# Altium schematic sheet 08-AUDIO_AUX.SchDoc
size B
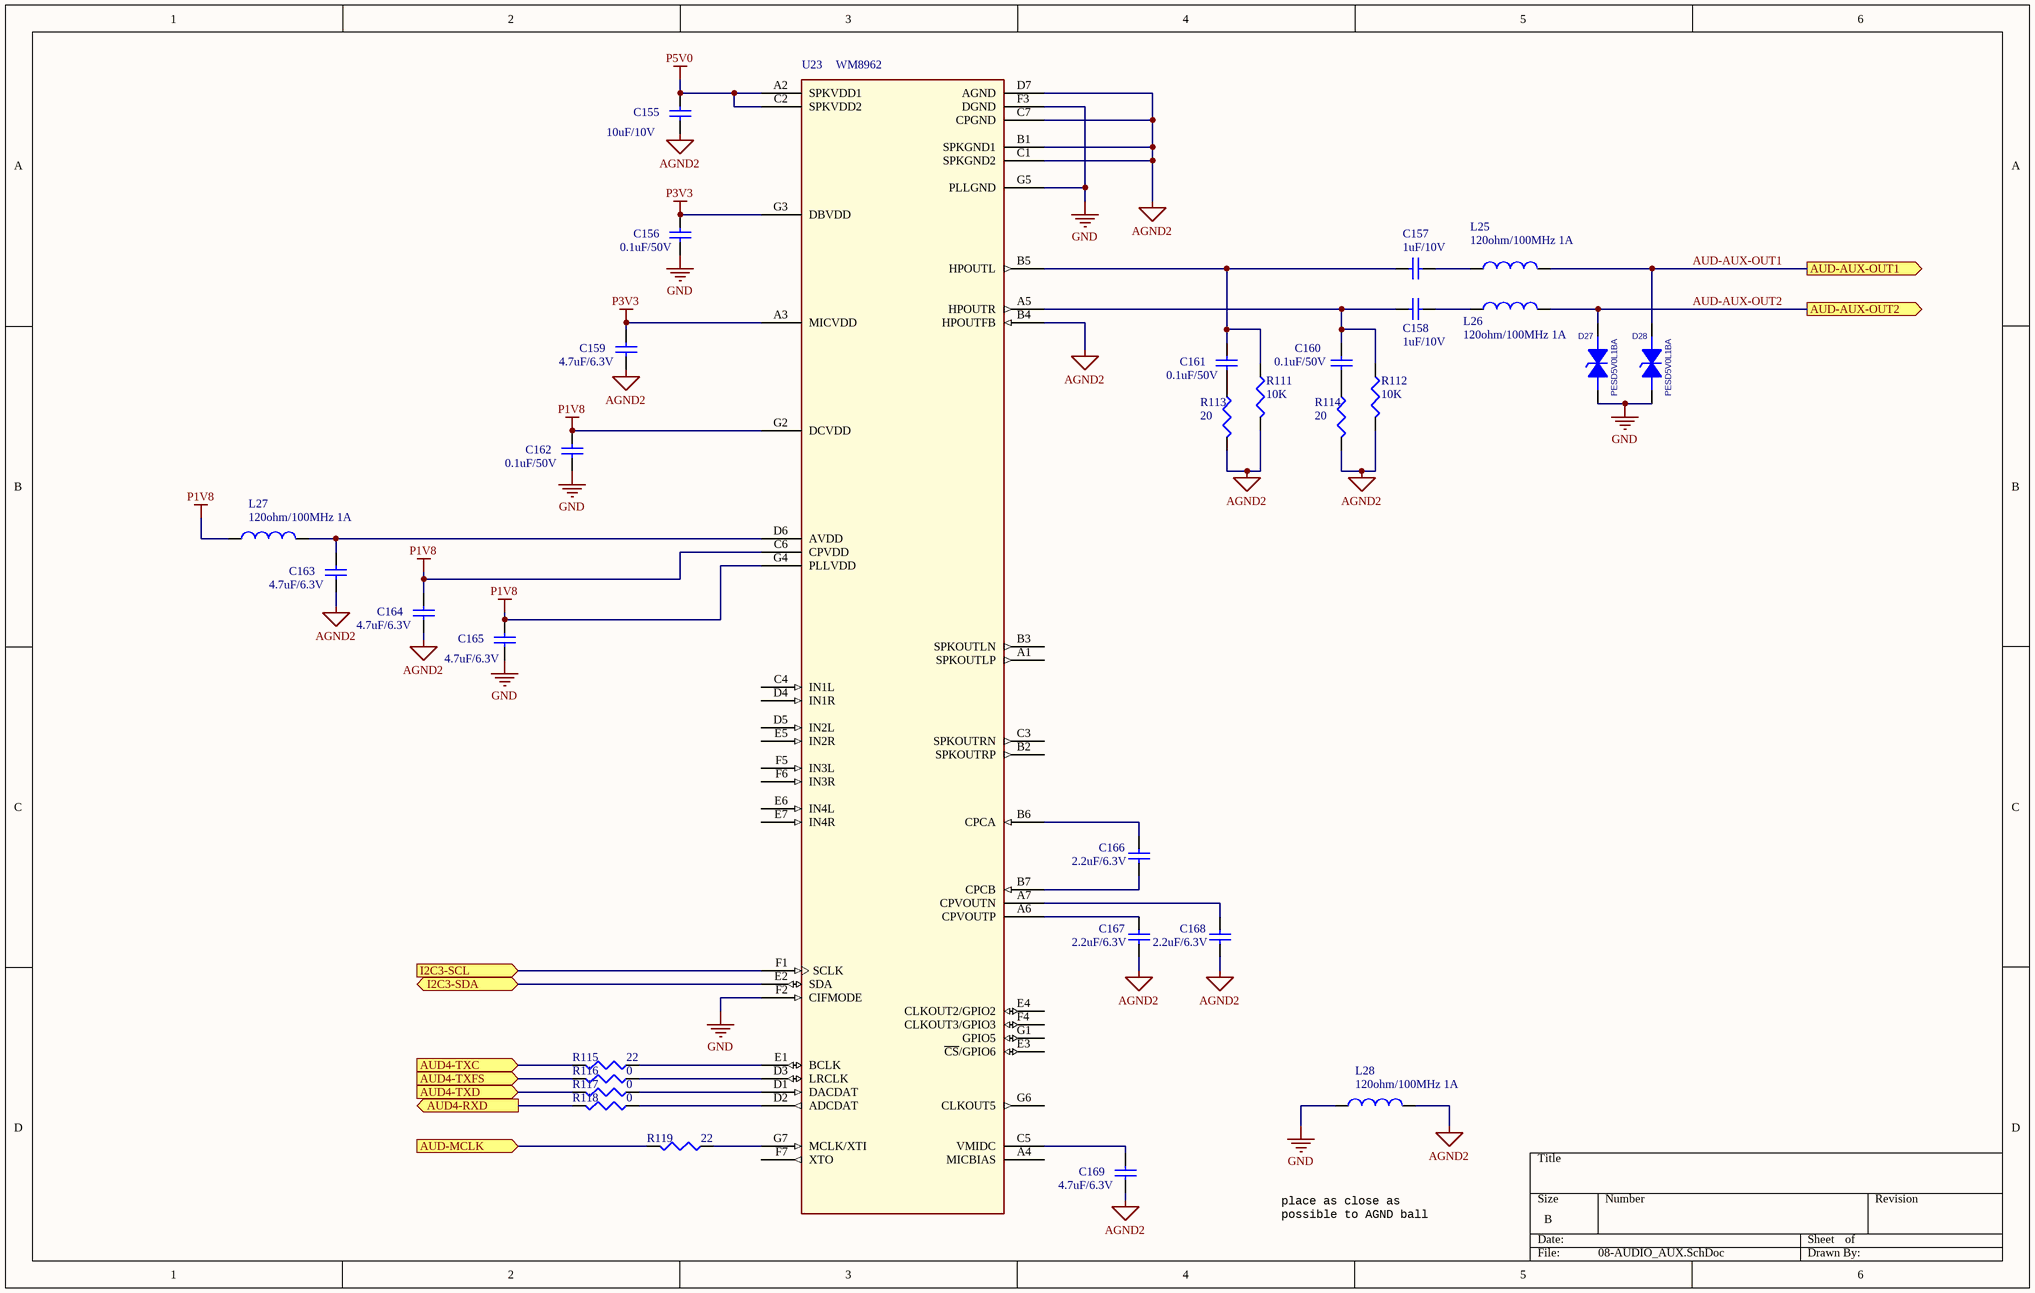
[diagram p0: 08-AUDIO_AUX.SchDoc]

## Parts
C155  10uF/10V  [0805]
C156  0.1uF/50V  [0402]
C157  1uF/10V  [0402]
C158  1uF/10V  [0402]
C159  4.7uF/6.3V  [0603]
C160  0.1uF/50V  [0402]
C161  0.1uF/50V  [0402]
C162  0.1uF/50V  [0402]
C163  4.7uF/6.3V  [0603]
C164  4.7uF/6.3V  [0603]
C165  4.7uF/6.3V  [0603]
C166  2.2uF/6.3V  [0402]
C167  2.2uF/6.3V  [0402]
C168  2.2uF/6.3V  [0402]
C169  4.7uF/6.3V  [0603]
D27  PESD5V0L1BA  [SOD323]
D28  PESD5V0L1BA  [SOD323]
L25  120ohm/100MHz 1A  [0603]
L26  120ohm/100MHz 1A  [0603]
L27  120ohm/100MHz 1A  [0603]
L28  120ohm/100MHz 1A  [0603]
R111  10K  [0402]
R112  10K  [0402]
R113  20  [0402]
R114  20  [0402]
R115  22  [0402]
R116  0  [0402]
R117  0  [0402]
R118  0  [0402]
R119  22  [0402]
U23  WM8962  [BGA49]

## Ports
AUD4-RXD (out), AUD4-TXC (in), AUD4-TXD (in), AUD4-TXFS (in), AUD-AUX-OUT1 (out), AUD-AUX-OUT2 (out), AUD-MCLK (in), I2C3-SCL (in), I2C3-SDA (bidir)

## Nets
AGND2: C155.1 C159.1 C163.1 C164.1 C167.1 C168.1 C169.1 L28.2 R111.2 R112.2 R113.2 R114.2 U23.B1(SPKGND1) U23.B4(HPOUTFB) U23.C1(SPKGND2) U23.C7(CPGND) U23.D7(AGND)
GND: C156.1 C162.1 C165.1 D27.1 D28.1 L28.1 U23.F2(CIFMODE) U23.F3(DGND) U23.G5(PLLGND)
P1V8: C162.2 C164.2 C165.2 L27.1 U23.C6(CPVDD) U23.G2(DCVDD) U23.G4(PLLVDD)
P3V3: C156.2 C159.2 U23.A3(MICVDD) U23.G3(DBVDD)
P5V0: C155.2 U23.A2(SPKVDD1) U23.C2(SPKVDD2)
AUD4-RXD: R118.2 ; port AUD4-RXD
AUD4-TXC: R115.2 ; port AUD4-TXC
AUD4-TXD: R117.2 ; port AUD4-TXD
AUD4-TXFS: R116.2 ; port AUD4-TXFS
AUD-AUX-OUT1: D28.2 L25.2 ; port AUD-AUX-OUT1
AUD-AUX-OUT2: D27.2 L26.2 ; port AUD-AUX-OUT2
AUD-MCLK: R119.2 ; port AUD-MCLK
I2C3-SCL: U23.F1(SCLK) ; port I2C3-SCL
I2C3-SDA: U23.E2(SDA) ; port I2C3-SDA
NetC157_1: C157.1 L25.1
NetC157_2: C157.2 C161.2 R111.1 U23.B5(HPOUTL)
NetC158_1: C158.1 L26.1
NetC158_2: C158.2 C160.2 R112.1 U23.A5(HPOUTR)
NetC160_1: C160.1 R114.1
NetC161_1: C161.1 R113.1
NetC163_2: C163.2 L27.2 U23.D6(AVDD)
NetC166_1: C166.1 U23.B7(CPCB)
NetC166_2: C166.2 U23.B6(CPCA)
NetC167_2: C167.2 U23.A6(CPVOUTP)
NetC168_2: C168.2 U23.A7(CPVOUTN)
NetC169_2: C169.2 U23.C5(VMIDC)
NetR115_1: R115.1 U23.E1(BCLK)
NetR116_1: R116.1 U23.D3(LRCLK)
NetR117_1: R117.1 U23.D1(DACDAT)
NetR118_1: R118.1 U23.D2(ADCDAT)
NetR119_1: R119.1 U23.G7(MCLK/XTI)

Not connected (* = marked no-connect by the designer): U23 A1(SPKOUTLP) A4(MICBIAS) B2(SPKOUTRP) B3(SPKOUTLN) C3(SPKOUTRN) C4(IN1L) D4(IN1R) D5(IN2L) E3(~{CS}/GPIO6) E4(CLKOUT2/GPIO2) E5(IN2R) E6(IN4L) E7(IN4R) F4(CLKOUT3/GPIO3) F5(IN3L) F6(IN3R) F7(XTO) G1(GPIO5) G6(CLKOUT5)

## Notes on the sheet
- place as close as
  possible to AGND ball

## Library data of the parts
C155-C169 = Cap: Capacitor; Published: 8-Jun-2000; LatestRevisionDate: 17-Jul-2002; LatestRevisionNote: Re-released for DXP Platform.; PackageReference: RAD-0.3; Publisher: Altium Limited; PackageDescription: Radial Cap, Thru-Hole; 2 Leads; 0.3 in Pin Spacing
D27 D28 = PESD
L25-L28 = Inductor: Code_IEC: 1005; Value: 300ohm/100MHz BEAD; Published: 8-Jun-2000; LatestRevisionDate: 29-May-2009; LatestRevisionNote: IPC-7351 Footprint Added.; PackageReference: 0402-A; Publisher: Altium Limited; PackageDescription: Chip Inductor; Code_JEITA: 0402
R111-R119 = CR16-1003FM
U23 = WM8962_BGA_49P_CUST: IC AUDIO CODEC 24BIT DAC 2 CH ADC 1.8V BGA49; AGILE_PN: 315-79434; MFG_NAME01: WOLFSON MICROELECTRONICS; MFG_PN01: WM8962ECSN/R; CAD_APPROVED: Yes; FPLIST: bga49_0p5_3p62x4,bga49_0p5_3p62x4_smdp; CLASS: IC; ROHS: Yes; HEIGHT: 0.75MM